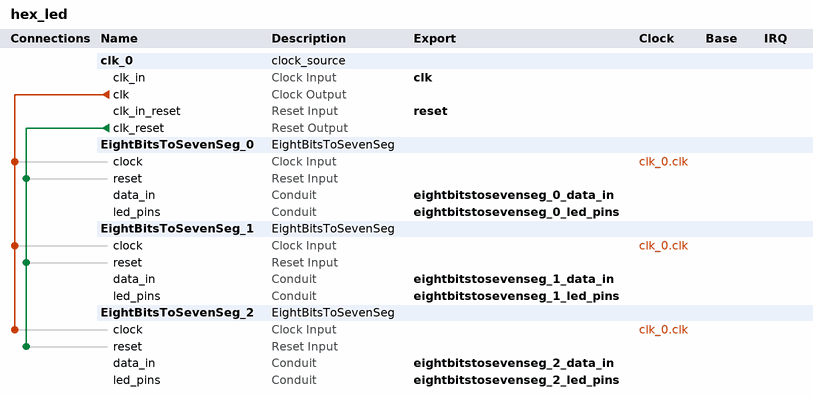
[diagram p0: system contents]
# Platform Designer (Qsys) system hex_led, Cyclone V 5CSEMA5F31C6
# Parameters at their usual value, and those the tool derives, are not listed.
package require -exact qsys 16.1
create_system hex_led
set_project_property DEVICE_FAMILY {Cyclone V}
set_project_property DEVICE 5CSEMA5F31C6

add_instance clk_0 clock_source 16.1
set_instance_parameter_value clk_0 clockFrequency 50000000

add_instance EightBitsToSevenSeg_0 EightBitsToSevenSeg 1.0

add_instance EightBitsToSevenSeg_1 EightBitsToSevenSeg 1.0

add_instance EightBitsToSevenSeg_2 EightBitsToSevenSeg 1.0

# connections
add_connection clk_0.clk EightBitsToSevenSeg_0.clock clock
add_connection clk_0.clk EightBitsToSevenSeg_1.clock clock
add_connection clk_0.clk EightBitsToSevenSeg_2.clock clock
add_connection clk_0.clk_reset EightBitsToSevenSeg_0.reset reset
add_connection clk_0.clk_reset EightBitsToSevenSeg_1.reset reset
add_connection clk_0.clk_reset EightBitsToSevenSeg_2.reset reset

# exported interfaces
add_interface clk clock sink
set_interface_property clk EXPORT_OF clk_0.clk_in
add_interface eightbitstosevenseg_0_data_in conduit end
set_interface_property eightbitstosevenseg_0_data_in EXPORT_OF EightBitsToSevenSeg_0.data_in
add_interface eightbitstosevenseg_0_led_pins conduit end
set_interface_property eightbitstosevenseg_0_led_pins EXPORT_OF EightBitsToSevenSeg_0.led_pins
add_interface eightbitstosevenseg_1_data_in conduit end
set_interface_property eightbitstosevenseg_1_data_in EXPORT_OF EightBitsToSevenSeg_1.data_in
add_interface eightbitstosevenseg_1_led_pins conduit end
set_interface_property eightbitstosevenseg_1_led_pins EXPORT_OF EightBitsToSevenSeg_1.led_pins
add_interface eightbitstosevenseg_2_data_in conduit end
set_interface_property eightbitstosevenseg_2_data_in EXPORT_OF EightBitsToSevenSeg_2.data_in
add_interface eightbitstosevenseg_2_led_pins conduit end
set_interface_property eightbitstosevenseg_2_led_pins EXPORT_OF EightBitsToSevenSeg_2.led_pins
add_interface reset reset sink
set_interface_property reset EXPORT_OF clk_0.clk_in_reset

set_interconnect_requirement {$system} qsys_mm.clockCrossingAdapter HANDSHAKE
set_interconnect_requirement {$system} qsys_mm.enableEccProtection FALSE
set_interconnect_requirement {$system} qsys_mm.insertDefaultSlave FALSE
set_interconnect_requirement {$system} qsys_mm.maxAdditionalLatency 1

save_system hex_led.qsys
